# Altium schematic sheet AMP.SchDoc
size A
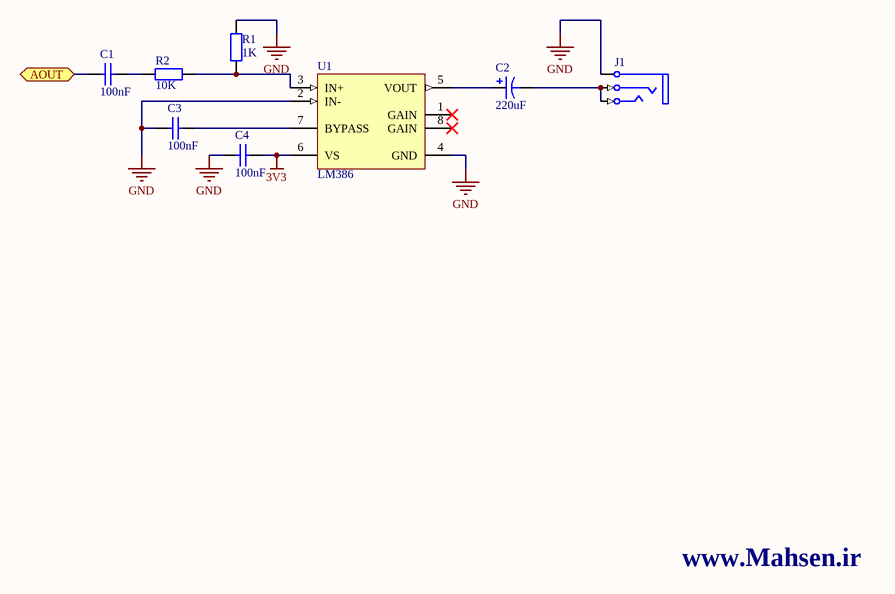
[diagram p0: AMP.SchDoc]

## Parts
C1  100nF  [0805]
C2  220uF  [CAPR5-4X5]
C3  100nF  [0805]
C4  100nF  [0805]
J1  Phonejack3  [KLD-0202]  (value not drawn)
R1  1K  [0805]
R2  10K  [0805]
U1  LM386  [M08A_L]

## Ports
AOUT (bidir)

## Nets
3V3: C4.1 U1.6(VS)
GND: C3.2 C4.2 J1.5(S) R1.2 U1.2(IN-) U1.4(GND)
AOUT: C1.2 ; port AOUT
NetC1_1: C1.1 R2.1
NetC2_1: C2.1 U1.5(VOUT)
NetC2_2: C2.2 J1.1(T) J1.3(R)
NetC3_1: C3.1 U1.7(BYPASS)
NetR1_1: R1.1 R2.2 U1.3(IN+)

Not connected (* = marked no-connect by the designer): U1 1(GAIN)* 8(GAIN)*

## Notes on the sheet
- www.Mahsen.ir

## Library data of the parts
C1 C3 C4 = Cap: Capacitor; Published: 8-Jun-2000; LatestRevisionDate: 17-Jul-2002; LatestRevisionNote: Re-released for DXP Platform.; PackageReference: RAD-0.3; Publisher: Altium Limited; PackageDescription: Radial Cap, Thru-Hole; 2 Leads; 0.3 in Pin Spacing; Value: 100nF
C2 = Cap Pol3: Polarized Capacitor (Surface Mount); Published: 8-Jun-2000; LatestRevisionDate: 29-May-2009; LatestRevisionNote: IPC-7351 Footprint Added.; PackageReference: C0805; Publisher: Altium Limited; PackageDescription: Chip Capacitor; Value: 220uF
J1 = Phonejack3: Jack Socket, 1/4" [6.5mm], Thru-Hole, Vertical, 3-Conductor Open Circuit (Non-Normalling); PackageDocument: 2003; PCB_Layout: Complies with manufacturer's recommendation.; DrillAndSlotSize: Corresponds to nominal value.; Published: 15-Jul-2004; LatestRevisionDate: 15-Jul-2004; LatestRevisionNote: Component Replaced.; DatasheetDocument: 2003; PackageReference: S1VS_SSS; Publisher: Altium Limited; ComponentLink1Description: Manufacturer Link; ComponentLink1URL: http://www.cliffuk.co.uk/
R1 R2 = Res2: Resistor; Published: 8-Jun-2000; LatestRevisionDate: 17-Jul-2002; LatestRevisionNote: Re-released for DXP Platform.; PackageReference: AXIAL-0.4; Publisher: Altium Limited; PackageDescription: Axial Device, Thru-Hole; 2 Leads; 0.4 in Pin Spacing
  R1: Value: 1K
  R2: Value: 10K
U1 = LM386MX-1: Low Voltage Audio Power Amplifier, 8-pin Narrow SOIC; Manufacturer: National Semiconductor; PackageTopMarking: NSZXTT*LM386*M-1; PowerWise: N; CompType: Audio IC; Published: 1-Mar-2010; DatasheetVersion: Aug-2000; PackageVersion: revM, May-2009; PackageReference: M08A; Publisher: Altium Limited; PackageDescription: SOIC Narrow, 4.9 x 3.9 x 1.45mm, 8 Lead, 1.27mm Pitch; PartNumber: LM386MX-1; RoHS: N; PinCount: 8; Code_JEDEC: MS-012-AA; Code_IPC: SOIC127P600-8; ComponentLink1Description: LM386 Datasheet; ComponentLink1URL: http://www.national.com/ds/LM/LM386.pdf; ComponentLink2Description: LM386 Web Page; ComponentLink2URL: http://www.national.com/pf/LM/LM386.html; ComponentLink3Description: M08A Package Page; ComponentLink3URL: http://www.national.com/packaging/folders/m08a.html